# Altium schematic sheet Sheet3.SchDoc
size A4
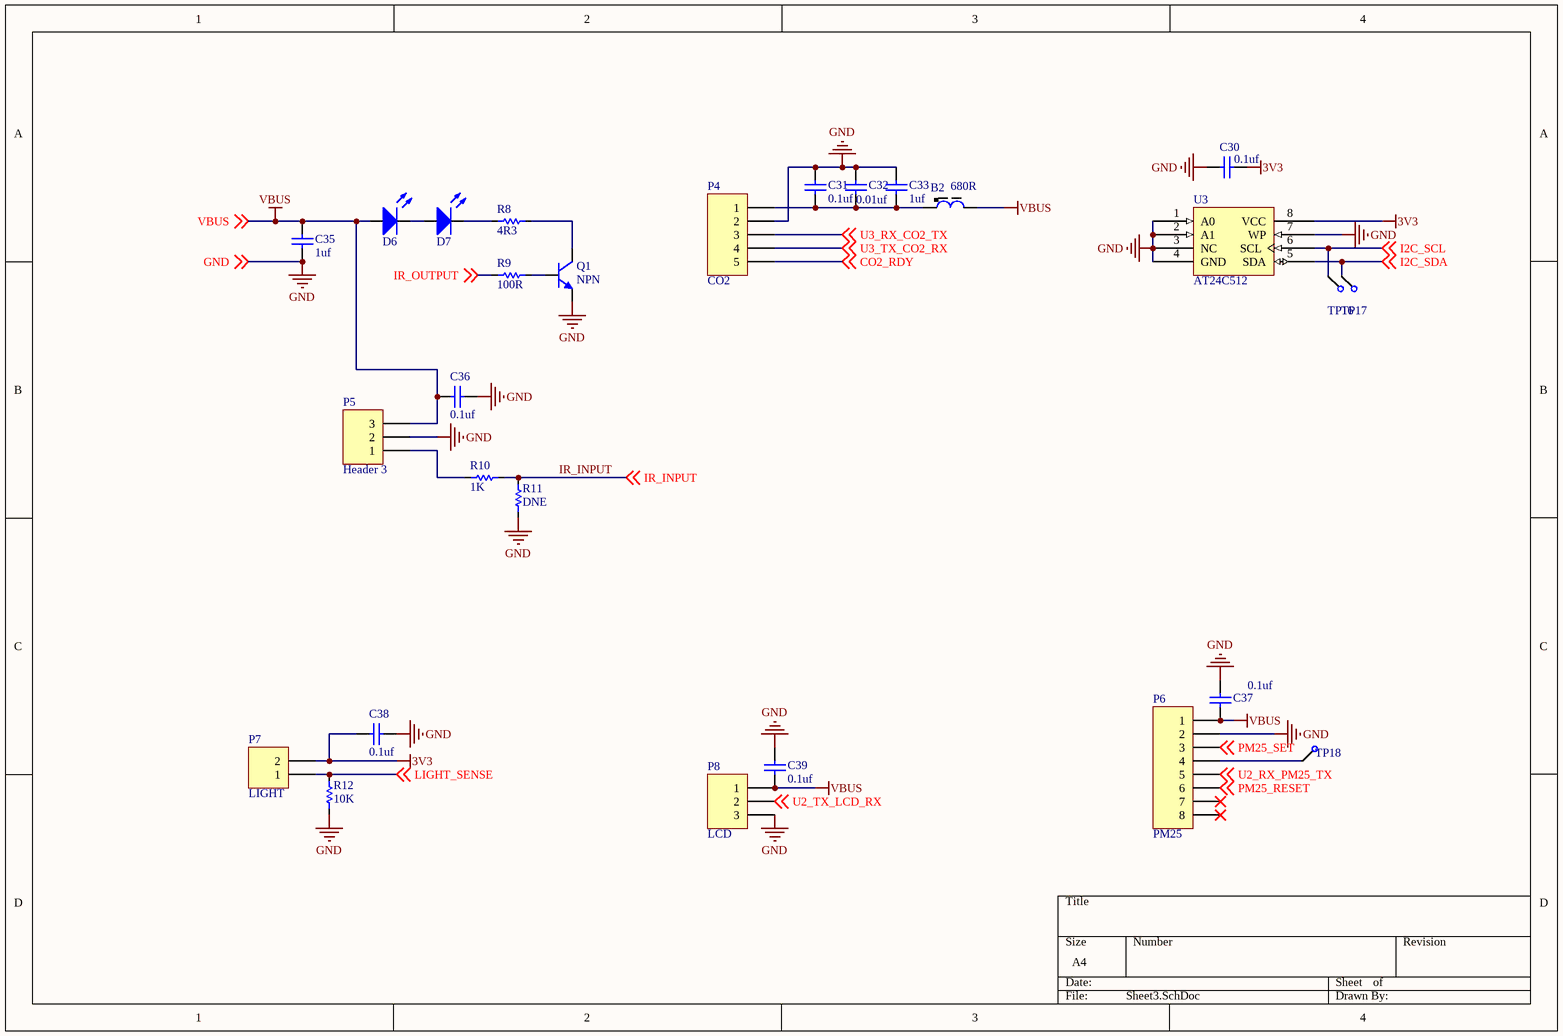
[diagram p0: Sheet3.SchDoc]

## Parts
B2  680R  [L0603]
C30  0.1uf  [C0603]
C31  0.1uf  [C0603]
C32  0.01uf  [C0603]
C33  1uf  [C0603]
C35  1uf  [C0603]
C36  0.1uf  [C0603]
C37  0.1uf  [C0603]
C38  0.1uf  [C0603]
C39  0.1uf  [C0603]
D6  LED-R  [LED_S]  (value not drawn)
D7  LED-R  [LED_S]  (value not drawn)
P4  CO2  [HDR1X5]
P5  Header 3  [HDR1X3]
P6  PM25  [1.25T-8P]
P7  LIGHT  [HDR1X2]
P8  LCD  [HDR1X3]
Q1  NPN  [SOT23_BJT]
R8  4R3  [R0805]
R9  100R  [R0603]
R10  1K  [R0603]
R11  DNE  [R0603]
R12  10K  [R0603]
TP16  TestPoint  [TP_0.8]  (value not drawn)
TP17  TestPoint  [TP_0.8]  (value not drawn)
TP18  TestPoint  [TP_0.8]  (value not drawn)
U3  AT24C512  [AT24C02]

## Nets
3V3: C30.2 C38.2 P7.2 U3.8(VCC)
GND: C30.1 C31.2 C32.2 C33.2 C35.1 C36.1 C37.2 C38.1 C39.2 P4.2 P5.2 P6.2 P8.3 Q1.1(E) R11.1 R12.1 U3.1(A0) U3.2(A1) U3.3(NC) U3.4(GND) U3.7(WP) ; off-sheet GND
VBUS: B2.2 C35.2 C36.2 C37.1 C39.1 D6.1(A) P5.3 P6.1 P8.1 ; off-sheet VBUS
CO2_RDY: P4.5 ; off-sheet CO2_RDY
I2C_SCL: TP16.1 U3.6(SCL) ; off-sheet I2C_SCL
I2C_SDA: TP17.1 U3.5(SDA) ; off-sheet I2C_SDA
IR_INPUT: R10.2 R11.2 ; off-sheet IR_INPUT
IR_OUTPUT: R9.1 ; off-sheet IR_OUTPUT
LIGHT_SENSE: P7.1 R12.2 ; off-sheet LIGHT_SENSE
PM25_RESET: P6.6 ; off-sheet PM25_RESET
PM25_SET: P6.3 ; off-sheet PM25_SET
U2_RX_PM25_TX: P6.5 ; off-sheet U2_RX_PM25_TX
U2_TX_LCD_RX: P8.2 ; off-sheet U2_TX_LCD_RX
U3_RX_CO2_TX: P4.3 ; off-sheet U3_RX_CO2_TX
U3_TX_CO2_RX: P4.4 ; off-sheet U3_TX_CO2_RX
NetB2_1: B2.1 C31.1 C32.1 C33.1 P4.1
NetD6_2: D6.2(K) D7.1(A)
NetD7_2: D7.2(K) R8.2
NetP5_1: P5.1 R10.1
NetP6_4: P6.4 TP18.1
NetQ1_2: Q1.2(B) R9.2
NetQ1_3: Q1.3(C) R8.1

Not connected (* = marked no-connect by the designer): P6 7* 8*

## Library data of the parts
B2 = L: Value: 680R
C30-C33 C35-C39 = Cap: Capacitor; Option: 25V  X7R
  C30 C31 C36-C39: Value: 0.1uf
  C32: Value: 0.01uf
  C33 C35: Value: 1uf
D6 D7 = LED: Typical INFRARED GaAs LED; Published: 8-Jun-2000; LatestRevisionDate: 08-Jul-2005; LatestRevisionNote: Mech Layer 1 removed.; PackageReference: LED-0; Publisher: Altium Limited; Color: LED-R
P4 = Header 5: Header, 5-Pin; LatestRevisionDate: 17-Jul-2002; LatestRevisionNote: Re-released for DXP Platform.; Publisher: Altium Limited
P5 P8 = Header 3: Header, 3-Pin; LatestRevisionDate: 17-Jul-2002; LatestRevisionNote: Re-released for DXP Platform.; Publisher: Altium Limited
P6 = Header 8: Header, 8-Pin; LatestRevisionDate: 17-Jul-2002; LatestRevisionNote: Re-released for DXP Platform.; Publisher: Altium Limited
P7 = Header 2: Header, 2-Pin; LatestRevisionDate: 17-Jul-2002; LatestRevisionNote: Re-released for DXP Platform.; Publisher: Altium Limited
Q1 = NPN: NPN Bipolar Transistor; Published: 8-Jun-2000; LatestRevisionDate: 17-Jul-2002; LatestRevisionNote: Re-released for DXP Platform.; PackageReference: TO-226; Publisher: Altium Limited; Code_JEDEC: TO-226-AA
R8-R12 = Res: Published: 8-Jun-2000; LatestRevisionDate: 17-Jul-2002; LatestRevisionNote: Re-released for DXP Platform.; PackageReference: AXIAL-0.3; Publisher: Altium Limited
  R8: Value: 4R3
  R9: Value: 100R
  R10: Value: 1K
  R11: Value: DNE
  R12: Value: 10K
TP16-TP18 = TestPoint: 一个测试点
U3 = AT24C512: 2-wire Serial  EEPROM  512K (65,536 x 8)